# EAGLE design reduktor ultra light (EAGLE 6.3)
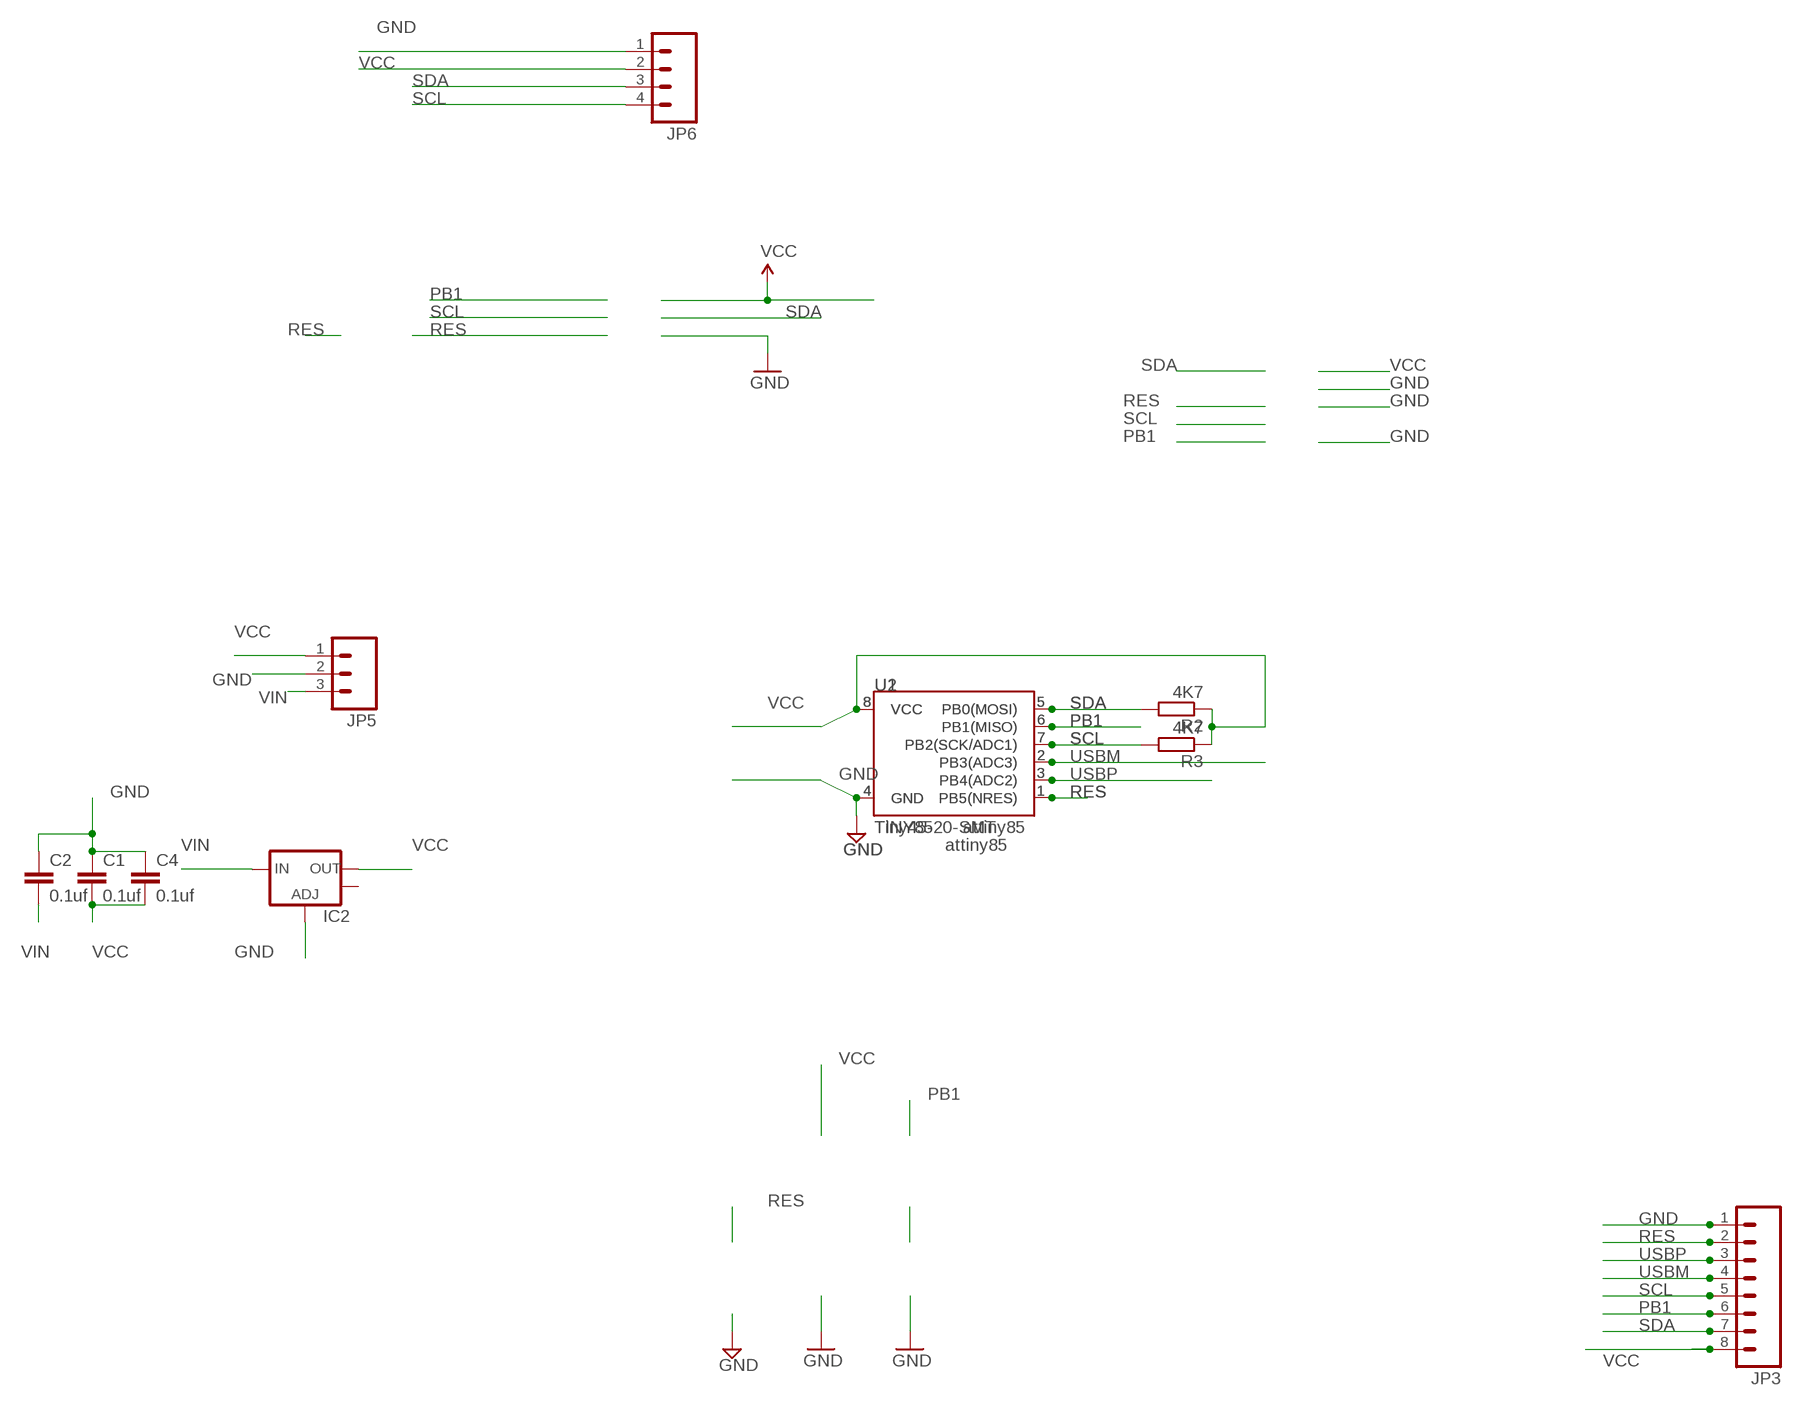
[diagram p0: schematic, sheet 1]

## Parts
C1  0.1uf  CAP0603-CAP  [0603-CAP]
C2  0.1uf  CAP0603-CAP  [0603-CAP]
C4  0.1uf  CAP0603-CAP  [0603-CAP]
IC2  V_REG_LM1117SOT223  [SOT223]
JP3  M08LOCK  [1X08_LOCK]
JP5  M03LOCK  [1X03_LOCK]
JP6  M04PTH  [1X04]
R2  4K7  R-EU_R0603  [R0603]
R3  4K7  R-EU_R0603  [R0603]
U1  TINY85  ATTINY45TINY45-20-DIP  [DIP08]
U2  Tiny45-20-SMT  ATTINY45TINY45-20-SMT  [SO08-EIAJ]

## Nets
GND: C1.1 C2.1 C4.1 IC2.1(ADJ) JP3.1 JP5.2 JP6.1 U1.4(GND) U2.4(GND)
PB1: JP3.6 U1.6(PB1(MISO)) U2.6(PB1(MISO))
RES: JP3.2 U1.1(PB5(NRES)) U2.1(PB5(NRES))
SCL: JP3.5 JP6.4 R3.2 U1.7(PB2(SCK/ADC1)) U2.7(PB2(SCK/ADC1))
SDA: JP3.7 JP6.3 R2.2 U1.5(PB0(MOSI)) U2.5(PB0(MOSI))
USBM: JP3.4 U1.2(PB3(ADC3)) U2.2(PB3(ADC3))
USBP: JP3.3 U1.3(PB4(ADC2)) U2.3(PB4(ADC2))
VCC [pwr]: C1.2 C4.2 IC2.2(OUT) JP3.8 JP5.1 JP6.2 R2.1 R3.1 U1.8(VCC) U2.8(VCC)
VIN: C2.2 IC2.3(IN) JP5.3
Unconnected: IC2.4(OUT)

## Notes on the sheet
- attiny85
- attiny85

## Library data of the parts
C1 C2 C4 = SparkFun:CAP: Capacitor Standard 0603 ceramic capacitor, and 0.1" leaded capacitor.
IC2 = SparkFun:V_REG_LM1117: Voltage Regulator LM1117 Standard adjustable voltage regulator but in SMD form. Spark Fun Electronics SKU : COM-00595
JP3 = SparkFun:M08: Header 8 Standard 8-pin 0.1" header. Use with straight break away headers (SKU : PRT-00116), right angle break away headers (PRT-00553), swiss pins (PRT-00743), machine pins (PRT-00117), and female headers (PRT-00115).
JP5 = SparkFun:M03: Header 3 Standard 3-pin 0.1" header. Use with straight break away headers (SKU : PRT-00116), right angle break away headers (PRT-00553), swiss pins (PRT-00743), machine pins (PRT-00117), and female headers (PRT-00115). Molex polarized connector foot print use with SKU : PRT-08232 with associated crimp pins and housings.
JP6 = SparkFun:M04: Header 4 Standard 4-pin 0.1" header. Use with straight break away headers (SKU : PRT-00116), right angle break away headers (PRT-00553), swiss pins (PRT-00743), machine pins (PRT-00117), and female headers (PRT-00115). Molex polarized connector foot print use with SKU : PRT-08231 with associated crimp pins and housings. 1MM SMD Version SKU: PRT-10208
R2 R3 = rcl:R-EU_: RESISTOR, European symbol
U1 = SparkFun-DigitalIC:ATTINY45: Atmel 8-pin 2/4/8kB flash uC; PROD_ID: IC-09439; VALUE: TINY45-20-DIP
U2 = SparkFun-DigitalIC:ATTINY45: Atmel 8-pin 2/4/8kB flash uC; PROD_ID: IC-08922

## Net classes
0 default: width 0.254 mm, drill 0.356 mm, clearance 0.254 mm
1 GND: width 0.254 mm, drill 0.356 mm, clearance 0.254 mm
2 pwr: width 0.254 mm, drill 0.356 mm, clearance 0.254 mm

## Board
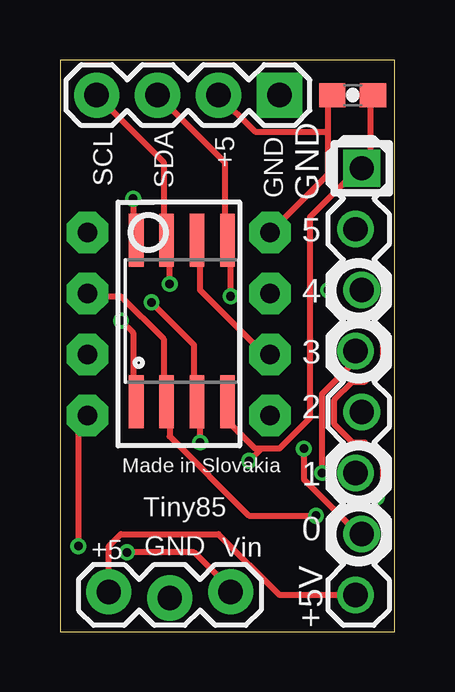
[diagram p1: board, top side]
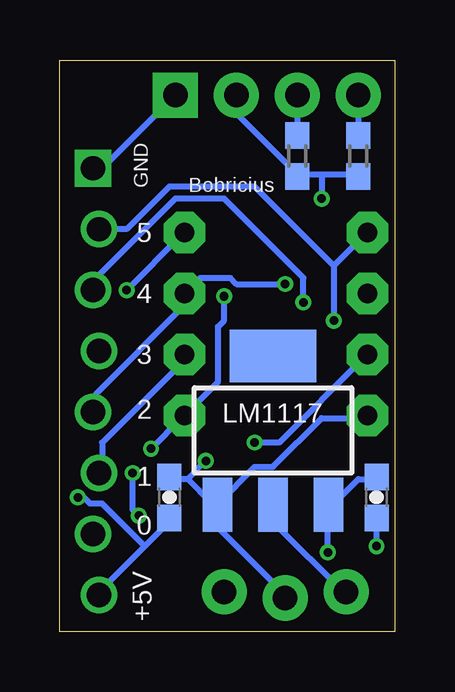
[diagram p2: board, bottom side, seen from below]

Size 13.95 x 23.82 mm. Coordinates in mm from the lower left corner, seen from the top.
Outline: 0,23.82 0,0 13.95,0 13.95,23.82 0,23.82
Copper layers (1*16): Top 0.035mm / dielectric 1.5mm / Bottom 0.035mm
Design rules "ITEADstudio_DRC": minimum track width 6mil, minimum drill 12mil, track to track 6mil, track to pad 6mil, pad to pad 6mil, via to via 6mil, smd to smd 0mil, copper to edge 10mil, drill to drill 10mil, minimum pad ring 10mil, minimum via ring 6mil, stop-mask expansion 2mil, vias tented up to drill 100mil, thermal gap 10mil

### Footprints (pad centres in the part's own frame; a part is rotated, then mirrored left to right if it is on the bottom)
0603-CAP = smd 1.1 x 1: 1 -0.85,0; 2 0.85,0
SOT223 = smd 1.219 x 2.235: 1 -2.311,-3.099; 2 0,-3.099; 3 2.311,-3.099 | smd 3.6 x 2.2: 4 0,3.099
1X08_LOCK = drill 1.016 square: 1 0,0.127 | drill 1.016: 2 2.54,-0.127; 3 5.08,0.127; 4 7.62,-0.127; 5 10.16,0.127; 6 12.7,-0.127; 7 15.24,0.127; 8 17.78,-0.127
1X03_LOCK = drill 1.016 pad 1.88: 1 0,0.127; 2 2.54,-0.127; 3 5.08,0.127
1X04 = drill 1.016 pad 1.88 square: 1 0,0 | drill 1.016 pad 1.88: 2 2.54,0; 3 5.08,0; 4 7.62,0
R0603 = smd 1.1 x 1: 1 -0.85,0; 2 0.85,0
DIP08 = drill 0.813 pad 1.727 octagon: 1 -3.81,-3.81; 2 -1.27,-3.81; 3 1.27,-3.81; 4 3.81,-3.81; 5 3.81,3.81; 6 1.27,3.81; 7 -1.27,3.81; 8 -3.81,3.81
SO08-EIAJ = smd 0.61 x 2.21: 1 -1.905,-3.378; 2 -0.635,-3.378; 3 0.635,-3.378; 4 1.905,-3.378; 5 1.905,3.353; 6 0.635,3.353; 7 -0.635,3.353; 8 -1.905,3.353

### Placement (x,y rotation side)
C1  9.4,5.59 270 bottom
C2  0.76,5.59 90 bottom
C4  12.19,22.36 180 top
IC2  5.08,8.39 0 bottom
JP3  12.45,19.31 270 top
JP5  2.03,1.53 0 top
JP6  9.14,22.36 180 top
R2  4.06,19.82 90 bottom
R3  1.52,19.82 90 bottom
U1  4.95,12.82 270 top
U2  5.08,12.96 0 top

### Tracks (layer width: path | path; a pad name or v marks a point on that pad's centre or on a via)
GND  (via drill 0.36)
  Top 0.254: v0.76,3.56 0.76,8.64 1.02,8.89 U1.4 | C4.1 12.95,22.36 12.95,19.56 12.7,19.31 JP3.1 12.45,19.31 10.41,17.28 10.41,8.89 9.14,7.62 8.38,7.62 | 8.38,7.62 8.13,7.62 7.11,8.64 7.11,9.4 U2.4 | 8.38,7.62 v7.87,7.12
  Bottom 0.254: v0.76,3.56 C2.1 | 8.64,6.35 9.4,6.35 C1.1 | 8.64,6.35 7.62,5.34 IC2.1 | IC2.1 7.37,5.08 7.37,4.32 4.57,1.53 JP5.2 | U1.4 1.27,8.89 3.05,8.89 5.08,6.86 5.84,6.86 7.37,5.34 IC2.1 | JP6.1 12.19,19.31 JP3.1 | v7.87,7.12 8.64,6.35
PB1
  Top 0.254: U2.6 5.84,16.26 5.84,14.23 8.64,11.43 U1.6
  Bottom 0.254: JP3.6 12.19,6.61 12.19,7.88 8.64,11.43 U1.6
RES  (via drill 0.36)
  Top 0.254: v2.54,12.96 3.05,12.45 3.05,9.66 U2.1
  Bottom 0.254: 2.54,15.24 v2.54,12.96 | 2.54,15.24 1.27,16.51 U1.1 | JP3.2 11.18,16.77 9.4,18.55 5.84,18.55 2.54,15.24
SCL  (via drill 0.36)
  Top 0.254: JP6.4 4.32,19.56 4.32,16.51 U2.7 4.57,16.26 v4.57,14.48
  Bottom 0.254: JP6.4 R3.2 | JP3.5 12.45,9.15 12.45,9.91 8.89,13.47 8.89,13.97 U1.7 8.64,14.23 8.13,14.74 6.86,14.74 6.6,14.48 v4.57,14.48
SDA  (via drill 0.36)
  Top 0.254: JP6.3 6.86,19.56 6.86,16.51 U2.5 7.11,16.26 v7.11,13.97 | v10.16,7.62 10.16,6.35 12.45,4.07 JP3.7
  Bottom 0.254: JP6.3 R2.2 | v10.16,7.62 8.89,8.89 U1.5 8.64,9.15 7.37,10.42 7.37,12.7 7.11,12.96 v7.11,13.97
USBM  (via drill 0.36)
  Top 0.254: U1.2 1.27,13.97 2.54,13.97 4.32,12.2 4.32,9.66 U2.2 4.57,9.4 4.57,8.13 7.87,4.83 v10.67,4.83 | v10.92,6.61 10.92,9.91 12.19,11.18 12.19,11.69 JP3.4
  Bottom 0.254: v10.92,6.61 10.92,5.08 v10.67,4.83
USBP  (via drill 0.36)
  Top 0.254: v5.84,7.88 5.84,9.4 U2.3 5.59,9.66 5.59,11.94 v3.81,13.72
  Bottom 0.254: v5.84,7.88 4.83,7.88 1.27,11.43 U1.3 | v3.81,13.72 3.81,14.74 7.11,18.04 9.14,18.04 12.45,14.74 12.45,14.23 JP3.3
VCC  (via drill 0.36)
  Top 0.254: 11.18,20.83 11.18,19.05 8.89,16.77 U1.8 | 11.18,20.83 11.18,22.36 C4.2 | v3.05,18.04 3.05,16.51 U2.8 | 11.18,20.83 8.13,20.83 JP6.2 | JP3.8 9.14,1.53 6.6,4.07 2.54,4.07 2.03,3.56 JP5.1 | v11.18,14.23 11.18,13.97 12.19,12.96 12.7,12.96 13.46,12.2 13.46,11.18 12.7,10.42 12.19,10.42 11.43,9.66 11.43,8.64 12.19,7.88 12.7,7.88 13.46,7.12 13.46,5.85 v13.21,5.59
  Bottom 0.254: 4.06,19.05 3.05,19.05 | 3.05,19.05 1.52,19.05 R3.1 | 4.06,19.05 6.6,21.59 JP6.2 | 4.06,19.05 R2.1 | 3.05,19.05 v3.05,18.04 | 10.41,3.56 12.45,1.53 JP3.8 | 10.41,3.56 9.4,4.58 C1.2 | IC2.2 5.08,4.58 2.03,1.53 JP5.1 | v11.18,14.23 8.89,16.51 U1.8 | v13.21,5.59 12.95,5.59 12.7,5.34 12.19,5.34 10.41,3.56
VIN  (via drill 0.36)
  Top 0.254: v2.79,3.31 5.59,3.31 7.11,1.78 JP5.3
  Bottom 0.254: C2.2 0.76,6.35 1.52,6.35 2.54,5.34 IC2.3 2.79,5.08 v2.79,3.31

### Text on the board
tNames: SCL | SDA | +5 | GND | GND | 5 | 4 | 3 | 2 | Made in Slovakia | Tiny85 | 1 | +5 | Vin | 0 | GND | +5V
bNames: Bobricius | GND | 5 | 4 | 3 | LM1117 | 2 | 1 | 0 | +5V